# Altium schematic sheet Driver.SchDoc: 8ch_RGB_Controller
size A4; ApprovedBy: Selyutin A.; CheckedBy: Selyutin A.; Author: Selyutin A.; CompanyName: Circuit Craft Lab; DrawnBy: Selyutin A.; Engineer: Selyutin A.; Organization: Circuit Craft Lab; Address1: Russia; Address2: Nevinnomissk; DocumentNumber: 6; Revision: 1.0; SheetNumber: 6; SheetTotal: 7
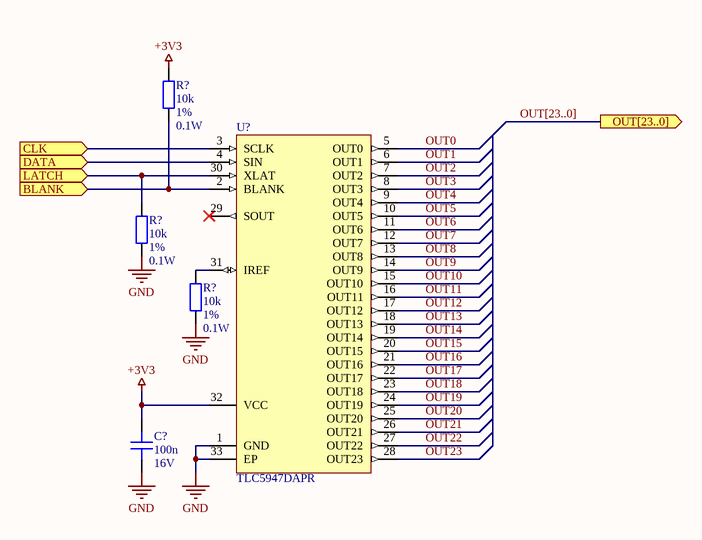
[diagram p0: Driver.SchDoc]

## Parts
(Parts that share a designator on the sheet are numbered #1, #2 ... from top to bottom, then left to right.)
C?  Capacitance: 100n  Voltage - Rated: 16V  [CAPC1608X09N]  (hidden comment: 0603B104K160NT)
R?#1  Resistance: 10k  Tolerance: 1%  Power (Watts): 0.1W  [RESC1608X06N]  (hidden comment: WR06X1002FTL)
R?#2  Resistance: 10k  Tolerance: 1%  Power (Watts): 0.1W  [RESC1608X06N]  (hidden comment: WR06X1002FTL)
R?#3  Resistance: 10k  Tolerance: 1%  Power (Watts): 0.1W  [RESC1608X06N]  (hidden comment: WR06X1002FTL)
U?  TLC5947DAPR  [TSOP65P810X120_HS-33N]

## Ports
BLANK (in), CLK (in), DATA (in), LATCH (in), OUT[23..0] (out)

## Nets
+3V3: C?.2 R?#1.2 U?.32(VCC)
GND: C?.1 R?#2.1 R?#3.1 U?.1(GND) U?.33(EP)
BLANK: R?#1.1 U?.2(BLANK) ; port BLANK
CLK: U?.3(SCLK) ; port CLK
DATA: U?.4(SIN) ; port DATA
LATCH: R?#2.2 U?.30(XLAT) ; port LATCH
OUT0: U?.5(OUT0)
OUT1: U?.6(OUT1)
OUT2: U?.7(OUT2)
OUT3: U?.8(OUT3)
OUT4: U?.9(OUT4)
OUT5: U?.10(OUT5)
OUT6: U?.11(OUT6)
OUT7: U?.12(OUT7)
OUT8: U?.13(OUT8)
OUT9: U?.14(OUT9)
OUT10: U?.15(OUT10)
OUT11: U?.16(OUT11)
OUT12: U?.17(OUT12)
OUT13: U?.18(OUT13)
OUT14: U?.19(OUT14)
OUT15: U?.20(OUT15)
OUT16: U?.21(OUT16)
OUT17: U?.22(OUT17)
OUT18: U?.23(OUT18)
OUT19: U?.24(OUT19)
OUT20: U?.25(OUT20)
OUT21: U?.26(OUT21)
OUT22: U?.27(OUT22)
OUT23: U?.28(OUT23)
NetR?#3_2: R?#3.2 U?.31(IREF)

Not connected (* = marked no-connect by the designer): U? 29(SOUT)*

## Buses and harness runs
bus OUT[23..0] = port OUT[23..0]

## Notes on the sheet
- Title:
- Author:
- Approved:
- Size:
- Date:
- Git Hash:
- A4
- Prj:
- SW Version:
- Variant:
- Edited:
- CONFIDENTIAL
- File:

## Library data of the parts
C? = 0603B104K160NT: 16V 100nF X7R ±10% 0603 Multilayer Ceramic Capacitors MLCC - SMD/SMT ROHS; Manufacturer: FH (Guangdong Fenghua Advanced Tech); Product Status: Active; PartNumber: 0603B104K160NT; ComponentLink1URL: https://datasheet.lcsc.com/lcsc/2201241400_FH--Guangdong-Fenghua-Advanced-Tech-0603B104K160NT_C2846678.pdf; ComponentLink1Description: Datasheet; Package: 0603; Series: -; Tolerance: 10%; Temperature Coefficient: X7R; Operating Temperature: -55 - 125 ℃; Features: -; Ratings: -; Applications: -; Failure Rate: -; Mounting Type: SMT; Package/Case: 0603; Size/Dimension: 1.6 x 0.8mm; Height-Seated (Max): 0.8mm; Thickness (Max): -; Lead Spacing: -; Lead Style: -
R?#1-R?#3 = WR06X1002FTL: 100mW 75V ±100ppm/℃ ±1% -55℃~+155℃ 10kΩ 0603 Chip Resistor - Surface Mount ROHS; Manufacturer: Walsin Tech Corp; Product Status: Active; PartNumber: WR06X1002FTL; ComponentLink1URL: https://datasheet.lcsc.com/lcsc/1811151132_Walsin-Tech-Corp-WR06X1002FTL_C108449.pdf; ComponentLink1Description: Datasheet; Package: 0603; Series: -; Composition: -; Features: -; Temperature Coefficient: 100ppm/℃; Operating Temperature: -55 -155 ℃; Package/Case: 0603; Ratings: 75V; Size/Dimension: 1.6 x 0.8mm; Height-Seated (Max): 0.6mm; Number of Terminations: -; Failure Rate: -
U? = TLC5947DAPR: LED Driver HTSSOP-32; Manufacturer: Texas Instruments; Product Status: Active; Topology: Shift register; Internal Switch(s): Yes; Number of Outputs: 24; Voltage - Supply (Min): 3V; Voltage - Supply (Max): 5.5V; Voltage - Output: 30V; Current - Output / Channel: 0.03A; Frequency: 4MHz; PartNumber: TLC5947DAPR; ComponentLink1URL: https://www.ti.com/lit/gpn/tlc5947; ComponentLink1Description: Datasheet; Package: TSOP-32EP; Series: -; Type: Linear; Dimming: -; Applications: Backlight; Operating Temperature: -40 - 85 °C; Mounting Type: SMT; Package / Case: TSOP-32EP